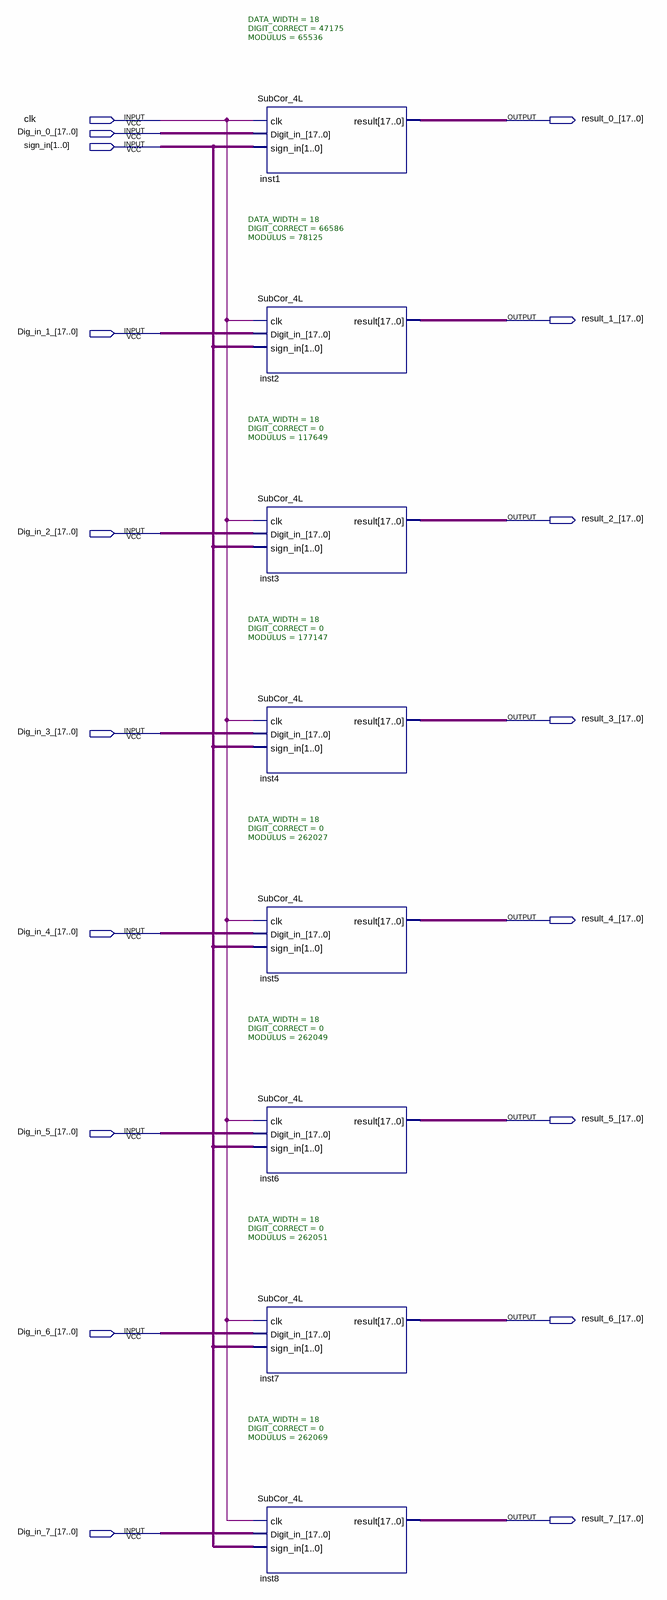
[diagram p0: schematic sheet]
// Quartus schematic SubCorStage_4L.bdf as structural Verilog: 8 symbols, 18 pins
module SubCorStage_4L (
  input  clk,
  input  [17:0] Dig_in_0_,
  input  [1:0] sign_in,
  input  [17:0] Dig_in_1_,
  input  [17:0] Dig_in_2_,
  input  [17:0] Dig_in_3_,
  input  [17:0] Dig_in_4_,
  input  [17:0] Dig_in_5_,
  input  [17:0] Dig_in_6_,
  input  [17:0] Dig_in_7_,
  output [17:0] result_0_,
  output [17:0] result_1_,
  output [17:0] result_2_,
  output [17:0] result_3_,
  output [17:0] result_4_,
  output [17:0] result_5_,
  output [17:0] result_6_,
  output [17:0] result_7_
);

  SubCor_4L #(.DATA_WIDTH(18), .DIGIT_CORRECT(47175), .MODULUS(65536)) inst1 (
    .clk(clk), .Digit_in_(Dig_in_0_), .sign_in(sign_in), .result(result_0_));
  SubCor_4L #(.DATA_WIDTH(18), .DIGIT_CORRECT(66586), .MODULUS(78125)) inst2 (
    .clk(clk), .Digit_in_(Dig_in_1_), .sign_in(sign_in), .result(result_1_));
  SubCor_4L #(.DATA_WIDTH(18), .DIGIT_CORRECT(0), .MODULUS(117649)) inst3 (
    .clk(clk), .Digit_in_(Dig_in_2_), .sign_in(sign_in), .result(result_2_));
  SubCor_4L #(.DATA_WIDTH(18), .DIGIT_CORRECT(0), .MODULUS(177147)) inst4 (
    .clk(clk), .Digit_in_(Dig_in_3_), .sign_in(sign_in), .result(result_3_));
  SubCor_4L #(.DATA_WIDTH(18), .DIGIT_CORRECT(0), .MODULUS(262027)) inst5 (
    .clk(clk), .Digit_in_(Dig_in_4_), .sign_in(sign_in), .result(result_4_));
  SubCor_4L #(.DATA_WIDTH(18), .DIGIT_CORRECT(0), .MODULUS(262049)) inst6 (
    .clk(clk), .Digit_in_(Dig_in_5_), .sign_in(sign_in), .result(result_5_));
  SubCor_4L #(.DATA_WIDTH(18), .DIGIT_CORRECT(0), .MODULUS(262051)) inst7 (
    .clk(clk), .Digit_in_(Dig_in_6_), .sign_in(sign_in), .result(result_6_));
  SubCor_4L #(.DATA_WIDTH(18), .DIGIT_CORRECT(0), .MODULUS(262069)) inst8 (
    .clk(clk), .Digit_in_(Dig_in_7_), .sign_in(sign_in), .result(result_7_));
endmodule
